# Altium schematic sheet ModuleSchema.SchDoc: CAN Current Loop Module
size A4; Author: Pablo R Nava; Engineer: Pablo R Nava
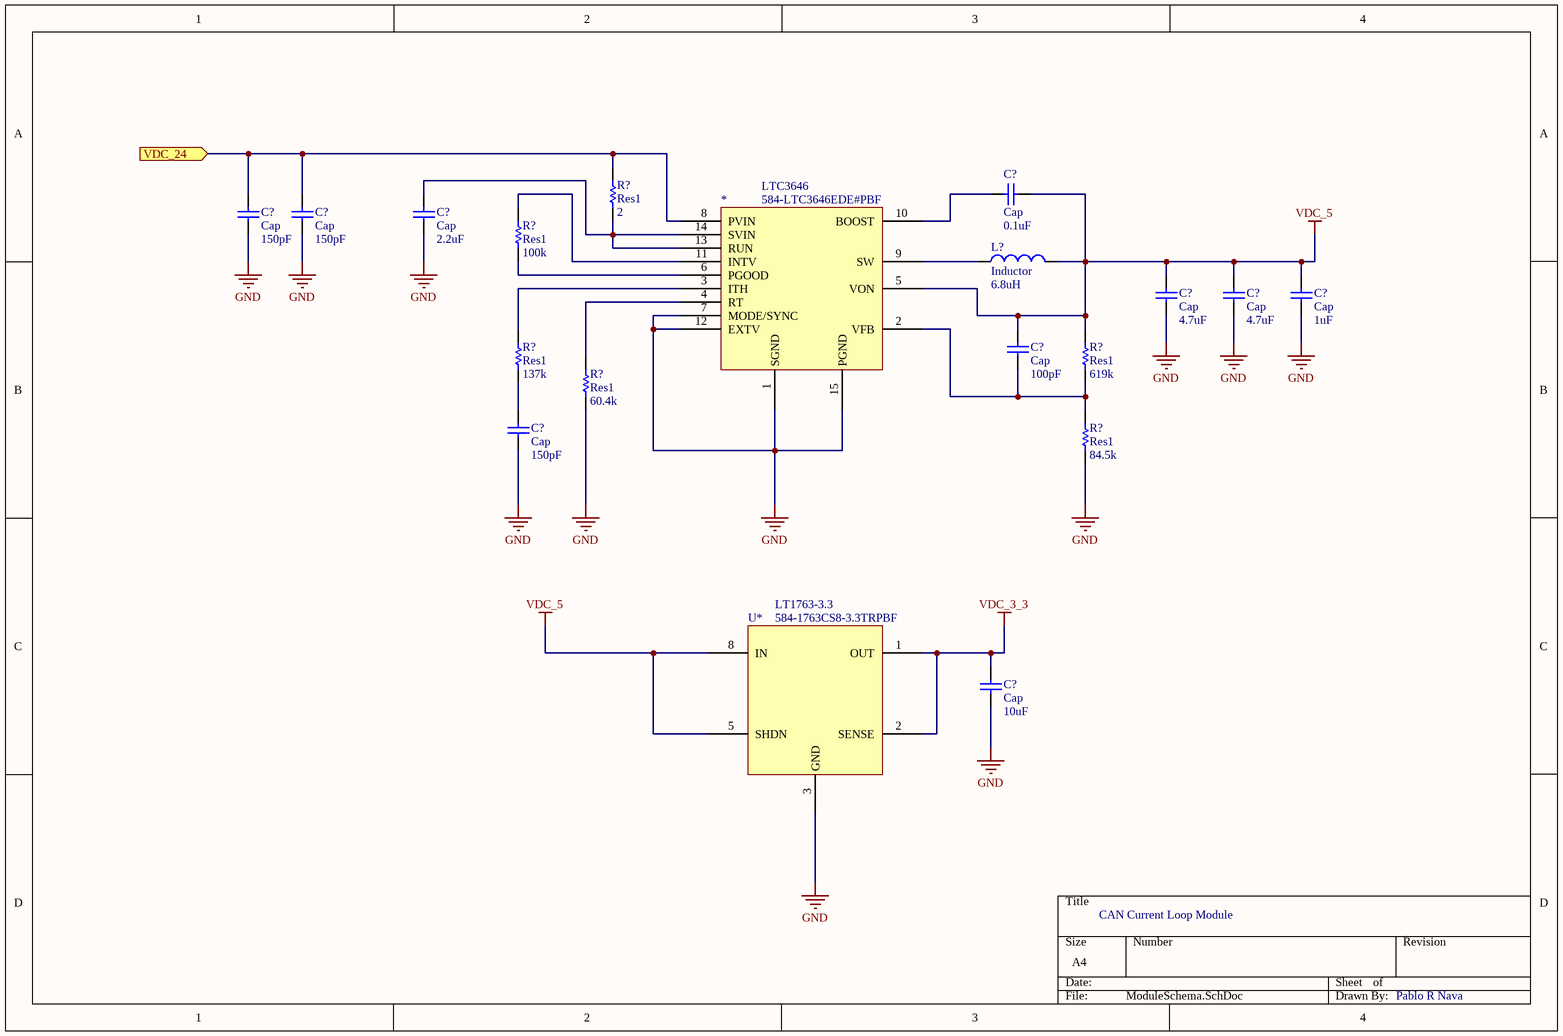
[diagram p0: ModuleSchema.SchDoc]

## Parts
(Parts that share a designator on the sheet are numbered #1, #2 ... from top to bottom, then left to right.)
*  LTC3646  Supplier Part Number 1: 584-LTC3646EDE#PBF
C?#1  Cap  value 0.1uF  [RAD-0.3]
C?#2  Cap  value 150pF  [RAD-0.3]
C?#3  Cap  value 150pF  [RAD-0.3]
C?#4  Cap  value 2.2uF  [RAD-0.3]
C?#5  Cap  value 4.7uF  [RAD-0.3]
C?#6  Cap  value 4.7uF  [RAD-0.3]
C?#7  Cap  value 1uF  [RAD-0.3]
C?#8  Cap  value 100pF  [RAD-0.3]
C?#9  Cap  value 150pF  [RAD-0.3]
C?#10  Cap  value 10uF  [RAD-0.3]
L?  Inductor  value 6.8uH  [0402-A]
R?#1  Res1  value 2  [AXIAL-0.3]
R?#2  Res1  value 100k  [AXIAL-0.3]
R?#3  Res1  value 137k  [AXIAL-0.3]
R?#4  Res1  value 619k  [AXIAL-0.3]
R?#5  Res1  value 60.4k  [AXIAL-0.3]
R?#6  Res1  value 84.5k  [AXIAL-0.3]
U*  LT1763-3.3  Supplier Part Number 1: 584-1763CS8-3.3TRPBF

## Ports
VDC_24 (in)

## Nets
GND: *.1(SGND) *.7(MODE/SYNC) *.12(EXTV) *.15(PGND) C?#2.1 C?#3.1 C?#4.1 C?#5.1 C?#6.1 C?#7.1 C?#9.1 C?#10.1 R?#5.1 R?#6.1 U*.3(GND)
VDC_3_3: C?#10.2 U*.1(OUT) U*.2(SENSE)
VDC_5: *.5(VON) C?#1.1 C?#5.2 C?#6.2 C?#7.2 C?#8.2 L?.2 R?#4.2 U*.5(SHDN) U*.8(IN)
VDC_24: *.8(PVIN) C?#2.2 C?#3.2 R?#1.1 ; port VDC_24
Net*_2: *.2(VFB) C?#8.1 R?#4.1 R?#6.2
Net*_3: *.3(ITH) R?#3.2
Net*_4: *.4(RT) R?#5.2
Net*_6: *.6(PGOOD) R?#2.2
Net*_9: *.9(SW) L?.1
Net*_10: *.10(BOOST) C?#1.2
Net*_11: *.11(INTV) R?#2.1
Net*_13: *.13(RUN) *.14(SVIN) C?#4.2 R?#1.2
NetC?#9_2: C?#9.2 R?#3.1

## Library data of the parts
C?#1-C?#10 = Cap: Capacitor; Published: 8-Jun-2000; LatestRevisionDate: 17-Jul-2002; LatestRevisionNote: Re-released for DXP Platform.; PackageReference: RAD-0.3; Publisher: Altium Limited; PackageDescription: Radial Cap, Thru-Hole; 2 Leads; 0.3 in Pin Spacing
L? = Inductor: Code_IEC: 1005; Published: 8-Jun-2000; LatestRevisionDate: 29-May-2009; LatestRevisionNote: IPC-7351 Footprint Added.; PackageReference: 0402-A; Publisher: Altium Limited; PackageDescription: Chip Inductor; Code_JEITA: 0402
R?#1-R?#6 = Res1: Resistor; Published: 8-Jun-2000; LatestRevisionDate: 17-Jul-2002; LatestRevisionNote: Re-released for DXP Platform.; PackageReference: AXIAL-0.3; Publisher: Altium Limited; PackageDescription: Axial Device, Thru-Hole; 2 Leads; 0.3 in Pin Spacing
* = LTC3646: Supplier 1: Mouser
U* = LT1763-3.3: Supplier 1: Mouser